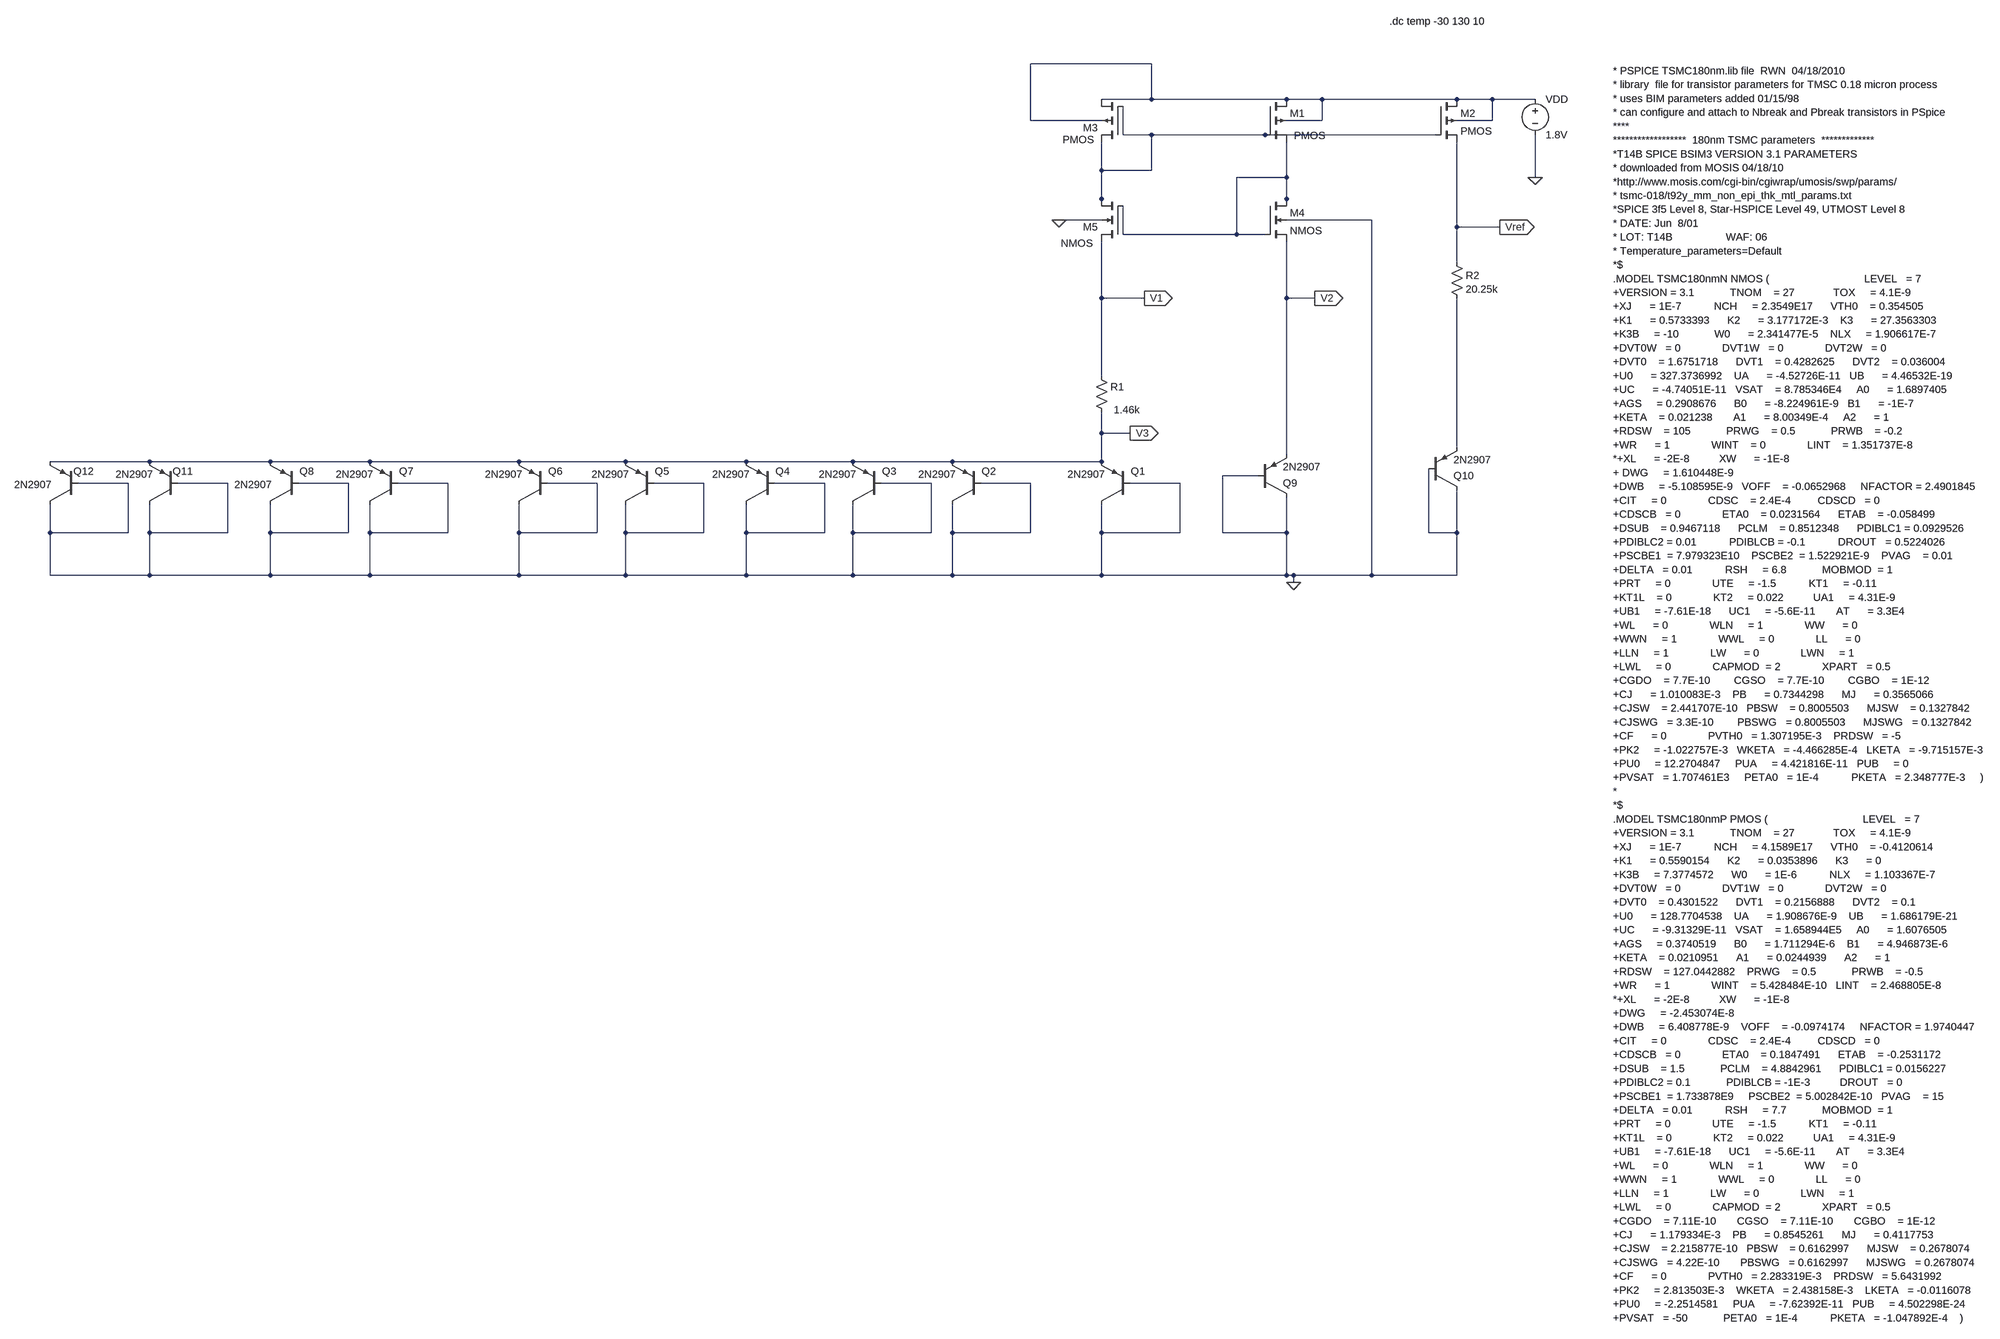
[diagram p0: schematic BGR_proj (1) (1).asc]
BGR_proj (1) (1).asc, the LTspice schematic file:
Version 4
SHEET 1 2280 3624
WIRE 208 -688 -64 -688
WIRE 208 -608 208 -688
WIRE 208 -608 96 -608
WIRE 512 -608 208 -608
WIRE 592 -608 512 -608
WIRE 896 -608 592 -608
WIRE 976 -608 896 -608
WIRE 1072 -608 976 -608
WIRE -64 -560 -64 -688
WIRE 96 -560 -64 -560
WIRE 592 -560 592 -608
WIRE 592 -560 512 -560
WIRE 976 -560 976 -608
WIRE 976 -560 896 -560
WIRE 144 -528 144 -592
WIRE 208 -528 144 -528
WIRE 464 -528 208 -528
WIRE 848 -528 464 -528
WIRE 96 -448 96 -512
WIRE 208 -448 208 -528
WIRE 208 -448 96 -448
WIRE 512 -432 512 -512
WIRE 512 -432 400 -432
WIRE 1072 -432 1072 -528
WIRE 96 -384 96 -448
WIRE 512 -384 512 -432
WIRE 96 -368 96 -384
WIRE 512 -368 512 -384
WIRE 0 -336 -16 -336
WIRE 96 -336 0 -336
WIRE 704 -336 512 -336
WIRE 896 -320 896 -512
WIRE 992 -320 896 -320
WIRE 144 -304 144 -368
WIRE 400 -304 400 -432
WIRE 400 -304 144 -304
WIRE 464 -304 400 -304
WIRE 896 -240 896 -320
WIRE 96 -160 96 -288
WIRE 192 -160 96 -160
WIRE 512 -160 512 -288
WIRE 576 -160 512 -160
WIRE 96 16 96 -160
WIRE 96 144 96 96
WIRE 160 144 96 144
WIRE 896 176 896 -160
WIRE 512 192 512 -160
WIRE -2048 208 -2272 208
WIRE -1776 208 -2048 208
WIRE -1552 208 -1776 208
WIRE -1216 208 -1552 208
WIRE -976 208 -1216 208
WIRE -704 208 -976 208
WIRE -464 208 -704 208
WIRE -240 208 -464 208
WIRE 96 208 96 144
WIRE 96 208 -240 208
WIRE 448 240 368 240
WIRE -2096 256 -2208 256
WIRE -1872 256 -1984 256
WIRE -1600 256 -1712 256
WIRE -1376 256 -1488 256
WIRE -1040 256 -1152 256
WIRE -800 256 -912 256
WIRE -528 256 -640 256
WIRE -288 256 -400 256
WIRE -64 256 -176 256
WIRE 272 256 160 256
WIRE -2272 368 -2272 304
WIRE -2096 368 -2096 256
WIRE -2096 368 -2272 368
WIRE -2048 368 -2048 304
WIRE -1872 368 -1872 256
WIRE -1872 368 -2048 368
WIRE -1776 368 -1776 304
WIRE -1600 368 -1600 256
WIRE -1600 368 -1776 368
WIRE -1552 368 -1552 304
WIRE -1376 368 -1376 256
WIRE -1376 368 -1552 368
WIRE -1216 368 -1216 304
WIRE -1040 368 -1040 256
WIRE -1040 368 -1216 368
WIRE -976 368 -976 304
WIRE -800 368 -800 256
WIRE -800 368 -976 368
WIRE -704 368 -704 304
WIRE -528 368 -528 256
WIRE -528 368 -704 368
WIRE -464 368 -464 304
WIRE -288 368 -288 256
WIRE -288 368 -464 368
WIRE -240 368 -240 304
WIRE -64 368 -64 256
WIRE -64 368 -240 368
WIRE 96 368 96 304
WIRE 272 368 272 256
WIRE 272 368 96 368
WIRE 368 368 368 240
WIRE 512 368 512 288
WIRE 512 368 368 368
WIRE 832 368 832 224
WIRE 896 368 896 272
WIRE 896 368 832 368
WIRE -2272 464 -2272 368
WIRE -2048 464 -2048 368
WIRE -2048 464 -2272 464
WIRE -1776 464 -1776 368
WIRE -1776 464 -2048 464
WIRE -1552 464 -1552 368
WIRE -1552 464 -1776 464
WIRE -1216 464 -1216 368
WIRE -1216 464 -1552 464
WIRE -976 464 -976 368
WIRE -976 464 -1216 464
WIRE -704 464 -704 368
WIRE -704 464 -976 464
WIRE -464 464 -464 368
WIRE -464 464 -704 464
WIRE -240 464 -240 368
WIRE -240 464 -464 464
WIRE 96 464 96 368
WIRE 96 464 -240 464
WIRE 512 464 512 368
WIRE 512 464 96 464
WIRE 528 464 512 464
WIRE 704 464 704 -336
WIRE 704 464 528 464
WIRE 896 464 896 368
WIRE 896 464 704 464
WIRE 528 480 528 464
FLAG 528 480 0
FLAG 1072 -432 0
FLAG 992 -320 Vref
IOPIN 992 -320 Out
FLAG 192 -160 V1
IOPIN 192 -160 Out
FLAG 576 -160 V2
IOPIN 576 -160 Out
FLAG 0 -336 0
FLAG 160 144 V3
IOPIN 160 144 Out
SYMBOL res 80 0 R0
WINDOW 3 43 91 Left 2
SYMATTR Value 1.46k
SYMATTR InstName R1
SYMBOL res 880 -256 R0
WINDOW 0 36 45 Left 2
SYMATTR InstName R2
SYMATTR Value 20.25k
SYMBOL pnp 160 304 R180
WINDOW 0 -34 74 Left 2
SYMATTR InstName Q1
SYMATTR Value 2N2907
SYMBOL pnp 448 288 M180
SYMATTR InstName Q9
SYMATTR Value 2N2907
SYMBOL pnp 832 272 M180
SYMATTR InstName Q10
SYMATTR Value 2N2907
SYMBOL pmos4 144 -512 R180
WINDOW 3 65 5 Left 2
SYMATTR InstName M3
SYMATTR Value2 l=180n w=2.85u
SYMBOL pmos4 464 -608 R0
WINDOW 3 65 82 Left 2
SYMATTR InstName M1
SYMATTR Value2 l=180n w=2.8u
SYMBOL pmos4 848 -608 R0
SYMATTR InstName M2
SYMATTR Value2 l=180n w=2.855u
SYMBOL nmos4 144 -288 R180
WINDOW 3 68 -4 Left 2
SYMATTR InstName M5
SYMATTR Value2 l=180n w=0.8u
SYMBOL nmos4 464 -384 R0
SYMATTR InstName M4
SYMATTR Value2 l=180n w=0.825u
SYMBOL voltage 1072 -624 R0
WINDOW 123 0 0 Left 0
WINDOW 39 0 0 Left 0
SYMATTR InstName VDD
SYMATTR Value 1.8V
SYMBOL pnp -176 304 R180
WINDOW 0 -34 74 Left 2
SYMATTR InstName Q2
SYMATTR Value 2N2907
SYMBOL pnp -400 304 R180
WINDOW 0 -34 74 Left 2
SYMATTR InstName Q3
SYMATTR Value 2N2907
SYMBOL pnp -640 304 R180
WINDOW 0 -34 74 Left 2
SYMATTR InstName Q4
SYMATTR Value 2N2907
SYMBOL pnp -912 304 R180
WINDOW 0 -34 74 Left 2
SYMATTR InstName Q5
SYMATTR Value 2N2907
SYMBOL pnp -1152 304 R180
WINDOW 0 -34 74 Left 2
SYMATTR InstName Q6
SYMATTR Value 2N2907
SYMBOL pnp -1488 304 R180
WINDOW 0 -34 74 Left 2
SYMATTR InstName Q7
SYMATTR Value 2N2907
SYMBOL pnp -1712 304 R180
WINDOW 0 -34 74 Left 2
WINDOW 3 60 44 Left 2
SYMATTR InstName Q8
SYMATTR Value 2N2907
SYMBOL pnp -1984 304 R180
WINDOW 0 -34 74 Left 2
SYMATTR InstName Q11
SYMATTR Value 2N2907
SYMBOL pnp -2208 304 R180
WINDOW 0 -34 74 Left 2
WINDOW 3 60 44 Left 2
SYMATTR InstName Q12
SYMATTR Value 2N2907
TEXT 744 -784 Left 2 !.dc temp -30 130 10
TEXT 1384 -672 Left 2 !* PSPICE TSMC180nm.lib file  RWN  04/18/2010\n* library  file for transistor parameters for TMSC 0.18 micron process\n* uses BIM parameters added 01/15/98\n* can configure and attach to Nbreak and Pbreak transistors in PSpice\n****\n******************  180nm TSMC parameters  *************\n*T14B SPICE BSIM3 VERSION 3.1 PARAMETERS\n* downloaded from MOSIS 04/18/10\n*http://www.mosis.com/cgi-bin/cgiwrap/umosis/swp/params/\n* tsmc-018/t92y_mm_non_epi_thk_mtl_params.txt\n*SPICE 3f5 Level 8, Star-HSPICE Level 49, UTMOST Level 8\n* DATE: Jun  8/01\n* LOT: T14B                  WAF: 06\n* Temperature_parameters=Default\n*$\n.MODEL TSMC180nmN NMOS (                                LEVEL   = 7\n+VERSION = 3.1            TNOM    = 27             TOX     = 4.1E-9\n+XJ      = 1E-7           NCH     = 2.3549E17      VTH0    = 0.354505\n+K1      = 0.5733393      K2      = 3.177172E-3    K3      = 27.3563303\n+K3B     = -10            W0      = 2.341477E-5    NLX     = 1.906617E-7\n+DVT0W   = 0              DVT1W   = 0              DVT2W   = 0\n+DVT0    = 1.6751718      DVT1    = 0.4282625      DVT2    = 0.036004\n+U0      = 327.3736992    UA      = -4.52726E-11   UB      = 4.46532E-19\n+UC      = -4.74051E-11   VSAT    = 8.785346E4     A0      = 1.6897405\n+AGS     = 0.2908676      B0      = -8.224961E-9   B1      = -1E-7\n+KETA    = 0.021238       A1      = 8.00349E-4     A2      = 1\n+RDSW    = 105            PRWG    = 0.5            PRWB    = -0.2\n+WR      = 1              WINT    = 0              LINT    = 1.351737E-8\n*+XL      = -2E-8          XW      = -1E-8         \n+ DWG     = 1.610448E-9\n+DWB     = -5.108595E-9   VOFF    = -0.0652968     NFACTOR = 2.4901845\n+CIT     = 0              CDSC    = 2.4E-4         CDSCD   = 0\n+CDSCB   = 0              ETA0    = 0.0231564      ETAB    = -0.058499\n+DSUB    = 0.9467118      PCLM    = 0.8512348      PDIBLC1 = 0.0929526\n+PDIBLC2 = 0.01           PDIBLCB = -0.1           DROUT   = 0.5224026\n+PSCBE1  = 7.979323E10    PSCBE2  = 1.522921E-9    PVAG    = 0.01\n+DELTA   = 0.01           RSH     = 6.8            MOBMOD  = 1\n+PRT     = 0              UTE     = -1.5           KT1     = -0.11\n+KT1L    = 0              KT2     = 0.022          UA1     = 4.31E-9\n+UB1     = -7.61E-18      UC1     = -5.6E-11       AT      = 3.3E4\n+WL      = 0              WLN     = 1              WW      = 0\n+WWN     = 1              WWL     = 0              LL      = 0\n+LLN     = 1              LW      = 0              LWN     = 1\n+LWL     = 0              CAPMOD  = 2              XPART   = 0.5\n+CGDO    = 7.7E-10        CGSO    = 7.7E-10        CGBO    = 1E-12\n+CJ      = 1.010083E-3    PB      = 0.7344298      MJ      = 0.3565066\n+CJSW    = 2.441707E-10   PBSW    = 0.8005503      MJSW    = 0.1327842\n+CJSWG   = 3.3E-10        PBSWG   = 0.8005503      MJSWG   = 0.1327842\n+CF      = 0              PVTH0   = 1.307195E-3    PRDSW   = -5\n+PK2     = -1.022757E-3   WKETA   = -4.466285E-4   LKETA   = -9.715157E-3\n+PU0     = 12.2704847     PUA     = 4.421816E-11   PUB     = 0\n+PVSAT   = 1.707461E3     PETA0   = 1E-4           PKETA   = 2.348777E-3     )\n*\n*$\n.MODEL TSMC180nmP PMOS (                                LEVEL   = 7\n+VERSION = 3.1            TNOM    = 27             TOX     = 4.1E-9\n+XJ      = 1E-7           NCH     = 4.1589E17      VTH0    = -0.4120614\n+K1      = 0.5590154      K2      = 0.0353896      K3      = 0\n+K3B     = 7.3774572      W0      = 1E-6           NLX     = 1.103367E-7\n+DVT0W   = 0              DVT1W   = 0              DVT2W   = 0\n+DVT0    = 0.4301522      DVT1    = 0.2156888      DVT2    = 0.1\n+U0      = 128.7704538    UA      = 1.908676E-9    UB      = 1.686179E-21\n+UC      = -9.31329E-11   VSAT    = 1.658944E5     A0      = 1.6076505\n+AGS     = 0.3740519      B0      = 1.711294E-6    B1      = 4.946873E-6\n+KETA    = 0.0210951      A1      = 0.0244939      A2      = 1\n+RDSW    = 127.0442882    PRWG    = 0.5            PRWB    = -0.5\n+WR      = 1              WINT    = 5.428484E-10   LINT    = 2.468805E-8\n*+XL      = -2E-8          XW      = -1E-8          \n+DWG     = -2.453074E-8\n+DWB     = 6.408778E-9    VOFF    = -0.0974174     NFACTOR = 1.9740447\n+CIT     = 0              CDSC    = 2.4E-4         CDSCD   = 0\n+CDSCB   = 0              ETA0    = 0.1847491      ETAB    = -0.2531172\n+DSUB    = 1.5            PCLM    = 4.8842961      PDIBLC1 = 0.0156227\n+PDIBLC2 = 0.1            PDIBLCB = -1E-3          DROUT   = 0\n+PSCBE1  = 1.733878E9     PSCBE2  = 5.002842E-10   PVAG    = 15\n+DELTA   = 0.01           RSH     = 7.7            MOBMOD  = 1\n+PRT     = 0              UTE     = -1.5           KT1     = -0.11\n+KT1L    = 0              KT2     = 0.022          UA1     = 4.31E-9\n+UB1     = -7.61E-18      UC1     = -5.6E-11       AT      = 3.3E4\n+WL      = 0              WLN     = 1              WW      = 0\n+WWN     = 1              WWL     = 0              LL      = 0\n+LLN     = 1              LW      = 0              LWN     = 1\n+LWL     = 0              CAPMOD  = 2              XPART   = 0.5\n+CGDO    = 7.11E-10       CGSO    = 7.11E-10       CGBO    = 1E-12\n+CJ      = 1.179334E-3    PB      = 0.8545261      MJ      = 0.4117753\n+CJSW    = 2.215877E-10   PBSW    = 0.6162997      MJSW    = 0.2678074\n+CJSWG   = 4.22E-10       PBSWG   = 0.6162997      MJSWG   = 0.2678074\n+CF      = 0              PVTH0   = 2.283319E-3    PRDSW   = 5.6431992\n+PK2     = 2.813503E-3    WKETA   = 2.438158E-3    LKETA   = -0.0116078\n+PU0     = -2.2514581     PUA     = -7.62392E-11   PUB     = 4.502298E-24\n+PVSAT   = -50            PETA0   = 1E-4           PKETA   = -1.047892E-4    )

The netlist it stands for:
* BGR_proj (1) (1).asc
R1 V1 V3 1.46k
R2 Vref N004 20.25k
Q1 0 0 V3 0 2N2907
Q9 0 0 V2 0 2N2907
Q10 0 0 N004 0 2N2907
M3 N002 N002 N001 N001 PMOS l=180n w=2.85u
M1 N001 N002 N003 N001 PMOS l=180n w=2.8u
M2 N001 N002 Vref N001 PMOS l=180n w=2.855u
M5 V1 N003 N002 0 NMOS l=180n w=0.8u
M4 N003 N003 V2 0 NMOS l=180n w=0.825u
VDD N001 0 1.8V
Q2 0 0 V3 0 2N2907
Q3 0 0 V3 0 2N2907
Q4 0 0 V3 0 2N2907
Q5 0 0 V3 0 2N2907
Q6 0 0 V3 0 2N2907
Q7 0 0 V3 0 2N2907
Q8 0 0 V3 0 2N2907
Q11 0 0 V3 0 2N2907
Q12 0 0 V3 0 2N2907
.model NPN NPN
.model PNP PNP
.lib standard.bjt
.model NMOS NMOS
.model PMOS PMOS
.lib standard.mos
.dc temp -30 130 10
* PSPICE TSMC180nm.lib file  RWN  04/18/2010
* library  file for transistor parameters for TMSC 0.18 micron process
* uses BIM parameters added 01/15/98
* can configure and attach to Nbreak and Pbreak transistors in PSpice
****
******************  180nm TSMC parameters  *************
*T14B SPICE BSIM3 VERSION 3.1 PARAMETERS
* downloaded from MOSIS 04/18/10
*http://www.mosis.com/cgi-bin/cgiwrap/umosis/swp/params/
* tsmc-018/t92y_mm_non_epi_thk_mtl_params.txt
*SPICE 3f5 Level 8, Star-HSPICE Level 49, UTMOST Level 8
* DATE: Jun  8/01
* LOT: T14B                  WAF: 06
* Temperature_parameters=Default
*$
.MODEL TSMC180nmN NMOS (                                LEVEL   = 7
+VERSION = 3.1            TNOM    = 27             TOX     = 4.1E-9
+XJ      = 1E-7           NCH     = 2.3549E17      VTH0    = 0.354505
+K1      = 0.5733393      K2      = 3.177172E-3    K3      = 27.3563303
+K3B     = -10            W0      = 2.341477E-5    NLX     = 1.906617E-7
+DVT0W   = 0              DVT1W   = 0              DVT2W   = 0
+DVT0    = 1.6751718      DVT1    = 0.4282625      DVT2    = 0.036004
+U0      = 327.3736992    UA      = -4.52726E-11   UB      = 4.46532E-19
+UC      = -4.74051E-11   VSAT    = 8.785346E4     A0      = 1.6897405
+AGS     = 0.2908676      B0      = -8.224961E-9   B1      = -1E-7
+KETA    = 0.021238       A1      = 8.00349E-4     A2      = 1
+RDSW    = 105            PRWG    = 0.5            PRWB    = -0.2
+WR      = 1              WINT    = 0              LINT    = 1.351737E-8
*+XL      = -2E-8          XW      = -1E-8
+ DWG     = 1.610448E-9
+DWB     = -5.108595E-9   VOFF    = -0.0652968     NFACTOR = 2.4901845
+CIT     = 0              CDSC    = 2.4E-4         CDSCD   = 0
+CDSCB   = 0              ETA0    = 0.0231564      ETAB    = -0.058499
+DSUB    = 0.9467118      PCLM    = 0.8512348      PDIBLC1 = 0.0929526
+PDIBLC2 = 0.01           PDIBLCB = -0.1           DROUT   = 0.5224026
+PSCBE1  = 7.979323E10    PSCBE2  = 1.522921E-9    PVAG    = 0.01
+DELTA   = 0.01           RSH     = 6.8            MOBMOD  = 1
+PRT     = 0              UTE     = -1.5           KT1     = -0.11
+KT1L    = 0              KT2     = 0.022          UA1     = 4.31E-9
+UB1     = -7.61E-18      UC1     = -5.6E-11       AT      = 3.3E4
+WL      = 0              WLN     = 1              WW      = 0
+WWN     = 1              WWL     = 0              LL      = 0
+LLN     = 1              LW      = 0              LWN     = 1
+LWL     = 0              CAPMOD  = 2              XPART   = 0.5
+CGDO    = 7.7E-10        CGSO    = 7.7E-10        CGBO    = 1E-12
+CJ      = 1.010083E-3    PB      = 0.7344298      MJ      = 0.3565066
+CJSW    = 2.441707E-10   PBSW    = 0.8005503      MJSW    = 0.1327842
+CJSWG   = 3.3E-10        PBSWG   = 0.8005503      MJSWG   = 0.1327842
+CF      = 0              PVTH0   = 1.307195E-3    PRDSW   = -5
+PK2     = -1.022757E-3   WKETA   = -4.466285E-4   LKETA   = -9.715157E-3
+PU0     = 12.2704847     PUA     = 4.421816E-11   PUB     = 0
+PVSAT   = 1.707461E3     PETA0   = 1E-4           PKETA   = 2.348777E-3     )
*
*$
.MODEL TSMC180nmP PMOS (                                LEVEL   = 7
+VERSION = 3.1            TNOM    = 27             TOX     = 4.1E-9
+XJ      = 1E-7           NCH     = 4.1589E17      VTH0    = -0.4120614
+K1      = 0.5590154      K2      = 0.0353896      K3      = 0
+K3B     = 7.3774572      W0      = 1E-6           NLX     = 1.103367E-7
+DVT0W   = 0              DVT1W   = 0              DVT2W   = 0
+DVT0    = 0.4301522      DVT1    = 0.2156888      DVT2    = 0.1
+U0      = 128.7704538    UA      = 1.908676E-9    UB      = 1.686179E-21
+UC      = -9.31329E-11   VSAT    = 1.658944E5     A0      = 1.6076505
+AGS     = 0.3740519      B0      = 1.711294E-6    B1      = 4.946873E-6
+KETA    = 0.0210951      A1      = 0.0244939      A2      = 1
+RDSW    = 127.0442882    PRWG    = 0.5            PRWB    = -0.5
+WR      = 1              WINT    = 5.428484E-10   LINT    = 2.468805E-8
*+XL      = -2E-8          XW      = -1E-8
+DWG     = -2.453074E-8
+DWB     = 6.408778E-9    VOFF    = -0.0974174     NFACTOR = 1.9740447
+CIT     = 0              CDSC    = 2.4E-4         CDSCD   = 0
+CDSCB   = 0              ETA0    = 0.1847491      ETAB    = -0.2531172
+DSUB    = 1.5            PCLM    = 4.8842961      PDIBLC1 = 0.0156227
+PDIBLC2 = 0.1            PDIBLCB = -1E-3          DROUT   = 0
+PSCBE1  = 1.733878E9     PSCBE2  = 5.002842E-10   PVAG    = 15
+DELTA   = 0.01           RSH     = 7.7            MOBMOD  = 1
+PRT     = 0              UTE     = -1.5           KT1     = -0.11
+KT1L    = 0              KT2     = 0.022          UA1     = 4.31E-9
+UB1     = -7.61E-18      UC1     = -5.6E-11       AT      = 3.3E4
+WL      = 0              WLN     = 1              WW      = 0
+WWN     = 1              WWL     = 0              LL      = 0
+LLN     = 1              LW      = 0              LWN     = 1
+LWL     = 0              CAPMOD  = 2              XPART   = 0.5
+CGDO    = 7.11E-10       CGSO    = 7.11E-10       CGBO    = 1E-12
+CJ      = 1.179334E-3    PB      = 0.8545261      MJ      = 0.4117753
+CJSW    = 2.215877E-10   PBSW    = 0.6162997      MJSW    = 0.2678074
+CJSWG   = 4.22E-10       PBSWG   = 0.6162997      MJSWG   = 0.2678074
+CF      = 0              PVTH0   = 2.283319E-3    PRDSW   = 5.6431992
+PK2     = 2.813503E-3    WKETA   = 2.438158E-3    LKETA   = -0.0116078
+PU0     = -2.2514581     PUA     = -7.62392E-11   PUB     = 4.502298E-24
+PVSAT   = -50            PETA0   = 1E-4           PKETA   = -1.047892E-4    )
.backanno
.end